# Altium schematic sheet Passive Balancing.SchDoc
size A3; SheetNumber: 2; SheetTotal: 3
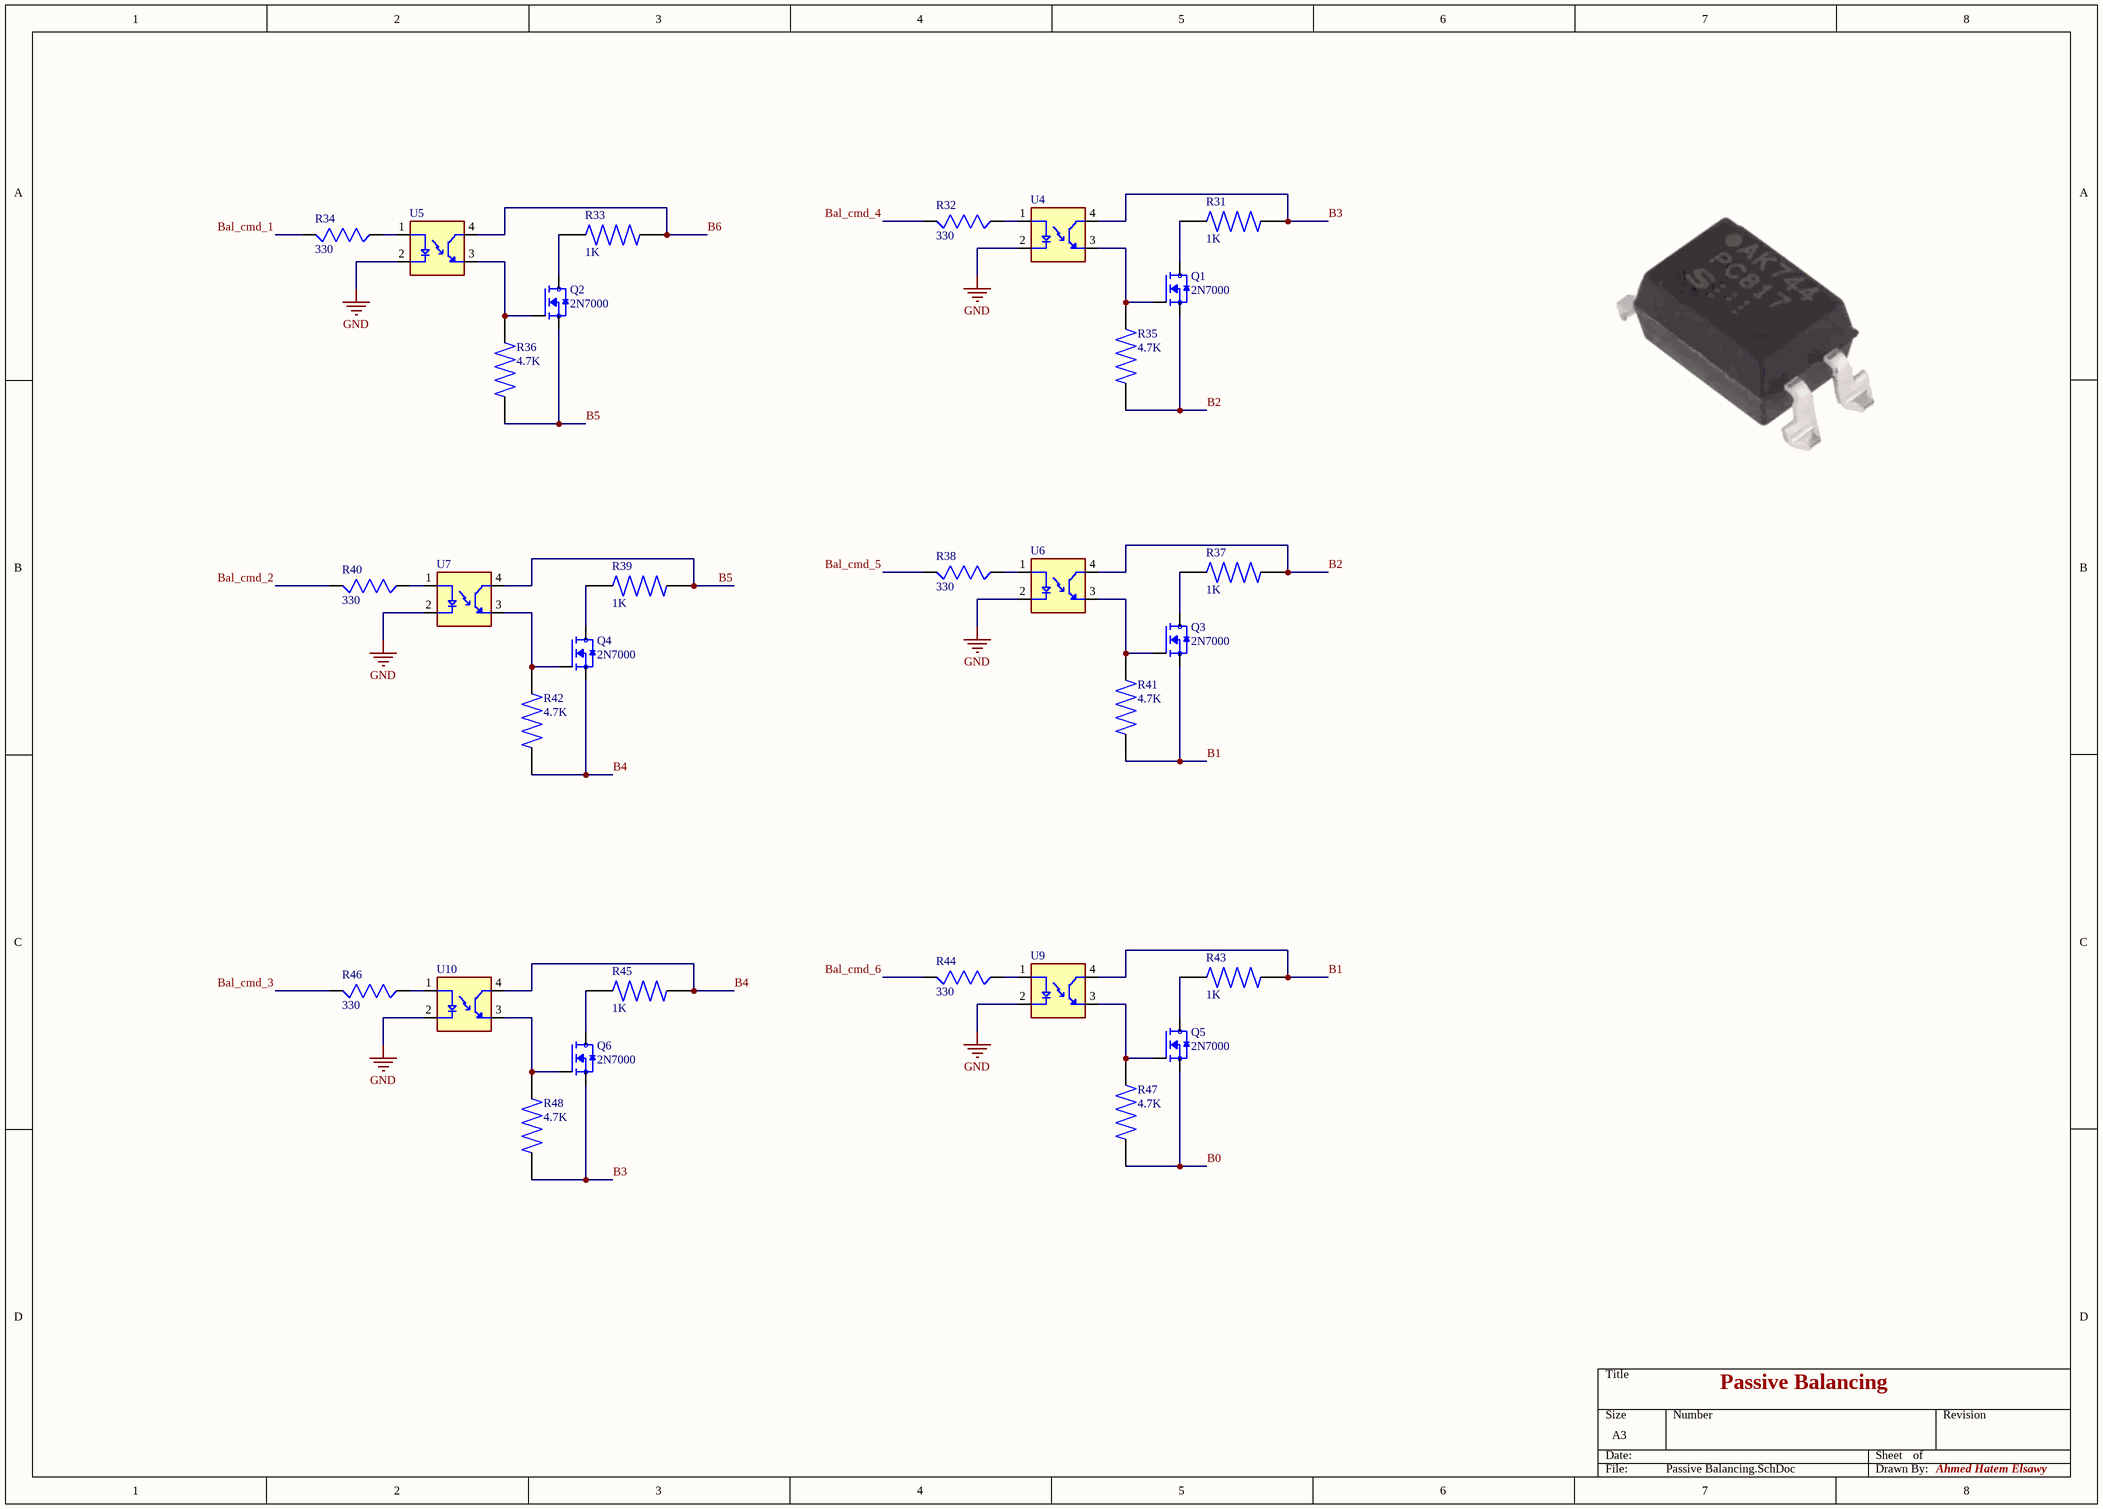
[diagram p0: Passive Balancing.SchDoc]

## Parts
Q1  2N7000  [TO92254P458H750-3]
Q2  2N7000  [TO92254P458H750-3]
Q3  2N7000  [TO92254P458H750-3]
Q4  2N7000  [TO92254P458H750-3]
Q5  2N7000  [TO92254P458H750-3]
Q6  2N7000  [TO92254P458H750-3]
R31  1K  [RESC1608X55N]
R32  330  [RESC3216X65]
R33  1K  [RESC1608X55N]
R34  330  [RESC3216X65]
R35  4.7K  [RES_ERJS06J472V]
R36  4.7K  [RES_ERJS06J472V]
R37  1K  [RESC1608X55N]
R38  330  [RESC3216X65]
R39  1K  [RESC1608X55N]
R40  330  [RESC3216X65]
R41  4.7K  [RES_ERJS06J472V]
R42  4.7K  [RES_ERJS06J472V]
R43  1K  [RESC1608X55N]
R44  330  [RESC3216X65]
R45  1K  [RESC1608X55N]
R46  330  [RESC3216X65]
R47  4.7K  [RES_ERJS06J472V]
R48  4.7K  [RES_ERJS06J472V]
U4  PC817X2NIP1B  [SOIC254P960X420-4N]  (value not drawn)
U5  PC817X2NIP1B  [SOIC254P960X420-4N]  (value not drawn)
U6  PC817X2NIP1B  [SOIC254P960X420-4N]  (value not drawn)
U7  PC817X2NIP1B  [SOIC254P960X420-4N]  (value not drawn)
U9  PC817X2NIP1B  [SOIC254P960X420-4N]  (value not drawn)
U10  PC817X2NIP1B  [SOIC254P960X420-4N]  (value not drawn)

## Nets
GND: U4.2(C) U5.2(C) U6.2(C) U7.2(C) U9.2(C) U10.2(C)
B0: Q5.1(S) R47.1
B1: Q3.1(S) R41.1 R43.2 U9.4(CT)
B2: Q1.1(S) R35.1 R37.2 U6.4(CT)
B3: Q6.1(S) R31.2 R48.1 U4.4(CT)
B4: Q4.1(S) R42.1 R45.2 U10.4(CT)
B5: Q2.1(S) R36.1 R39.2 U7.4(CT)
B6: R33.2 U5.4(CT)
Bal_cmd_1: R34.1
Bal_cmd_2: R40.1
Bal_cmd_3: R46.1
Bal_cmd_4: R32.1
Bal_cmd_5: R38.1
Bal_cmd_6: R44.1
NetQ1_2: Q1.2(G) R35.2 U4.3(ET)
NetQ1_3: Q1.3(D) R31.1
NetQ2_2: Q2.2(G) R36.2 U5.3(ET)
NetQ2_3: Q2.3(D) R33.1
NetQ3_2: Q3.2(G) R41.2 U6.3(ET)
NetQ3_3: Q3.3(D) R37.1
NetQ4_2: Q4.2(G) R42.2 U7.3(ET)
NetQ4_3: Q4.3(D) R39.1
NetQ5_2: Q5.2(G) R47.2 U9.3(ET)
NetQ5_3: Q5.3(D) R43.1
NetQ6_2: Q6.2(G) R48.2 U10.3(ET)
NetQ6_3: Q6.3(D) R45.1
NetR32_2: R32.2 U4.1(A)
NetR34_2: R34.2 U5.1(A)
NetR38_2: R38.2 U6.1(A)
NetR40_2: R40.2 U7.1(A)
NetR44_2: R44.2 U9.1(A)
NetR46_2: R46.2 U10.1(A)

## Notes on the sheet
- Passive Balancing
- Ahmed Hatem Elsawy

## Library data of the parts
Q1-Q6 = 2N7000: N-Channel 60 V 350mA (Tc) 1W (Tc) Through Hole TO-92-3; MF: STMicroelectronics; SnapEDA_Link: https://www.snapeda.com/parts/2N7000/STMicroelectronics/view-part/?ref=snap; Package: Package; Value: *; MP: 2N7000; Check_prices: https://www.snapeda.com/parts/2N7000/STMicroelectronics/view-part/?ref=eda
R31 R33 R37 R39 R43 R45 = CR0603AFX-1001EAS: DirenÃ§, AS 0603 1k %1 100mW TC100 ¦ Bourns CR0603AFX-1001EAS; SnapEDA_Link: https://www.snapeda.com/parts/CR0603AFX-1001EAS/Bourns/view-part/?ref=snap; Package: 0603-2 Bourns; Value: *; MF: Bourns; MP: CR0603AFX-1001EAS; Check_prices: https://www.snapeda.com/parts/CR0603AFX-1001EAS/Bourns/view-part/?ref=eda
R32 R34 R38 R40 R44 R46 = RC1206JR-13330RL: Res Thick Film 1206 330 Ohm 5% 0.25W(1/4W) Â±100ppm/Â°C Epoxy Pad SMD T/R; MF: Yageo Corporation; MP: RC1206JR13330RL; SnapEDA_Link: https://www.snapeda.com/parts/RC1206JR13330RL/Yageo/view-part/?ref=snap; Package: 1206-2 YAGEO; Value: *; Check_prices: https://www.snapeda.com/parts/RC1206JR13330RL/Yageo/view-part/?ref=eda
R35 R36 R41 R42 R47 R48 = ERJS06J472V: Price: None; Availability: Unavailable; MP: ERJS06J472V; Package: None; Value: *
U4-U7 U9 U10 = PC817X2NIP1B: Optocoupler DC-IN 1-CH Transistor DC-OUT 4-Pin DIP SMD T/R; MF: Sharp Microelectronics; SnapEDA_Link: https://www.snapeda.com/parts/PC817X2NIP1B/Sharp+Microelectronics/view-part/?ref=snap; Package: SMD-4 Sharp Microelectronics; Value: *; MP: PC817X2NIP1B; Check_prices: https://www.snapeda.com/parts/PC817X2NIP1B/Sharp+Microelectronics/view-part/?ref=eda